# Altium schematic sheet MCU.SchDoc
size A; SheetNumber: 1; SheetTotal: 1
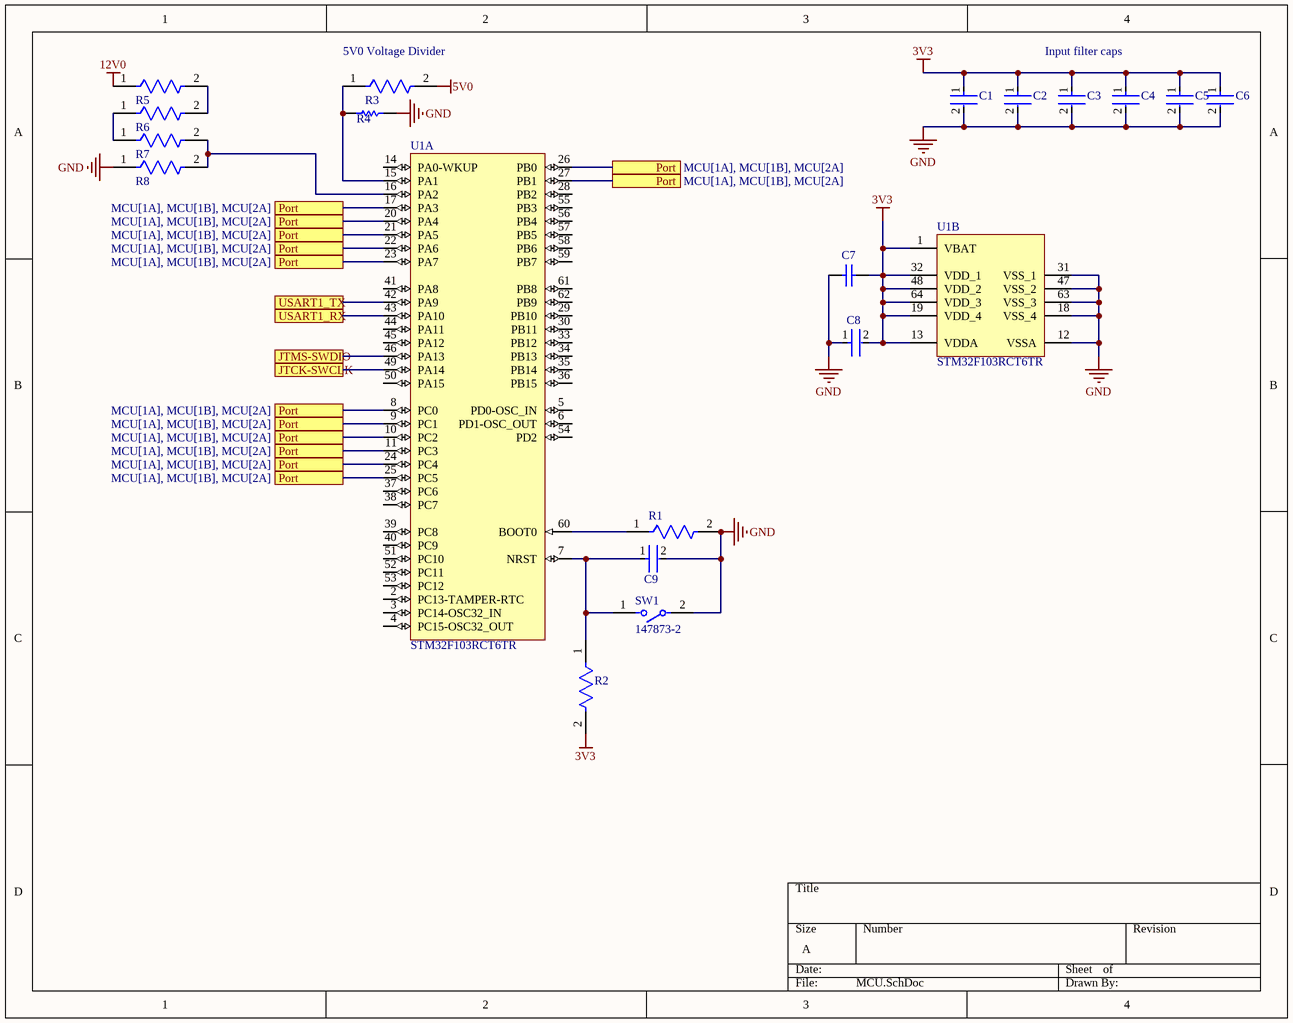
[diagram p0: MCU.SchDoc]

## Parts
C1  CL05A104KA5NNNC  [FP-CL278-IPC_C]  (value not drawn)
C2  CL05A104KA5NNNC  [FP-CL278-IPC_C]  (value not drawn)
C3  CL05A104KA5NNNC  [FP-CL278-IPC_C]  (value not drawn)
C4  CL05A104KA5NNNC  [FP-CL278-IPC_C]  (value not drawn)
C5  CL05A104KA5NNNC  [FP-CL278-IPC_C]  (value not drawn)
C6  CL05A104KA5NNNC  [FP-CL278-IPC_C]  (value not drawn)
C7  CL10A475KQ8NNNC  [CAPC1608X90X30LL10T20]  (value not drawn)
C8  CL10A105KA8NNNC  [FP-CL10-IPC_C]  (value not drawn)
C9  CL05A104KA5NNNC  [FP-CL278-IPC_C]  (value not drawn)
R1  RC0603FR-07100KL  [FP-RC0603-0_55-MFG]  (value not drawn)
R2  RC0603FR-07100KL  [FP-RC0603-0_55-MFG]  (value not drawn)
R3  RC0603FR-07100KL  [FP-RC0603-0_55-MFG]  (value not drawn)
R4  RN73H1ETTP1503B25  [RESC1005X40X25NL10T10]  (value not drawn)
R5  RC0603FR-07100KL  [FP-RC0603-0_55-MFG]  (value not drawn)
R6  RC0603FR-07100KL  [FP-RC0603-0_55-MFG]  (value not drawn)
R7  RC0603FR-07100KL  [FP-RC0603-0_55-MFG]  (value not drawn)
R8  RC0603FR-07100KL  [FP-RC0603-0_55-MFG]  (value not drawn)
SW1  147873-2  [FP-147873-2-MFG]
U1  STM32F103RCT6TR  [STM-LQFP64_N]  (parts A,B of 2)

## Ports
JTCK-SWCLK, JTMS-SWDIO, Port (see MCU[1A], MCU[1B], MCU[2A]), USART1_RX, USART1_TX

## Nets
3V3: C1.1 C2.1 C3.1 C4.1 C5.1 C6.1 C7.1 C8.2 R2.2 U1.1(VBAT) U1.13(VDDA) U1.19(VDD_4) U1.32(VDD_1) U1.48(VDD_2) U1.64(VDD_3)
5V0: R3.2
12V0: R5.1
GND: C1.2 C2.2 C3.2 C4.2 C5.2 C6.2 C7.2 C8.1 C9.2 R1.2 R4.2 R8.1 SW1.2 U1.12(VSSA) U1.18(VSS_4) U1.31(VSS_1) U1.47(VSS_2) U1.63(VSS_3)
JTCK-SWCLK: U1.49(PA14) ; port JTCK-SWCLK
JTMS-SWDIO: U1.46(PA13) ; port JTMS-SWDIO
Port: U1.8(PC0) U1.9(PC1) U1.10(PC2) U1.11(PC3) U1.17(PA3) U1.20(PA4) U1.21(PA5) U1.22(PA6) U1.23(PA7) U1.24(PC4) U1.25(PC5) U1.26(PB0) U1.27(PB1) ; port Port
USART1_RX: U1.43(PA10) ; port USART1_RX
USART1_TX: U1.42(PA9) ; port USART1_TX
NetC9_1: C9.1 R2.1 SW1.1 U1.7(NRST)
NetR1_1: R1.1 U1.60(BOOT0)
NetR3_1: R3.1 R4.1 U1.15(PA1)
NetR5_2: R5.2 R6.2
NetR6_1: R6.1 R7.1
NetR7_2: R7.2 R8.2 U1.16(PA2)

Not connected (* = marked no-connect by the designer): U1 2(PC13-TAMPER-RTC) 3(PC14-OSC32_IN) 4(PC15-OSC32_OUT) 5(PD0-OSC_IN) 6(PD1-OSC_OUT) 14(PA0-WKUP) 28(PB2) 29(PB10) 30(PB11) 33(PB12) 34(PB13) 35(PB14) 36(PB15) 37(PC6) 38(PC7) 39(PC8) 40(PC9) 41(PA8) 44(PA11) 45(PA12) 50(PA15) 51(PC10) 52(PC11) 53(PC12) 54(PD2) 55(PB3) 56(PB4) 57(PB5) 58(PB6) 59(PB7) 61(PB8) 62(PB9)

## Notes on the sheet
- (near R3) 5V0 Voltage Divider
- Input filter caps

## Library data of the parts
C1-C6 C9 = CMP-13271-000728-1: Cap Ceramic 100nF 25V X5R ±10% SMD 0402 +85°C Paper T/R; Package Quantity: 1; Height: 0.5mm; Case Code (Metric): 1005; Thickness: 0.022inch; Mount: Surface Mount; Lead Free: Lead Free; Case Code (Imperial): 0402; Packaging: Tape and Reel; Depth: 0.5mm; Voltage: 25V; Min Operating Temperature: -55°C; Voltage Rating: 25V; Dielectric: X5R; Case/Package: 0402; Tolerance: 10%; Width: 0.02inch; Max Operating Temperature: 85°C; Capacitance: 100nF; Length: 1mm; Radiation Hardening: No; Voltage Rating (DC): 25V
C7 = CMP-2000-06090-1: Chip Capacitor, 4.7 uF, +/- 10%, 6.3 V, -55 to 85 degC, 0603 (1608 Metric), RoHS, Tape and Reel; Manufacturer: Samsung Electro-Mechanics; Dielectric: X5R; Capacitance: 4700000pF; Rated Voltage: 6.3V; Manufacturer URL: http://www.samsungsem.com/global/index.jsp; Case Size/Dimension: 0603; Package Description: 2-Pin Surface Mount Device, Body 1.60 x 0.80 mm; Datasheet Version: 07/2016; Datasheet URL: http://www.samsungsem.com/kr/support/product-search/mlcc/__icsFiles/afieldfile/2016/08/18/S_CL10A475KQ8NNNC.pdf; Tolerance (%): ±10%; Mounting Technology: SurfaceMount; Package Reference: 0603
C8 = CMP-13271-004127-1: Cap Ceramic 1uF 25V X5R ±10% Pad SMD 0603 +85°C T/R; Height: 0.8mm; Capacitance: 1uF; Depth: 0.8mm; Package Quantity: 1; Mount: Surface Mount; Contact Plating: Tin; Voltage Rating: 25V; Dielectric: X5R; Packaging: Tape and Reel; Material: Ceramic; Case Code (Metric): 1608; Length: 1.6mm; Voltage: 25V; Min Operating Temperature: -55°C; Width: 0.031inch; Tolerance: 10%; Case/Package: 0603; Radiation Hardening: No; Case Code (Imperial): 0603; Thickness: 0.035inch; Lead Free: Lead Free; Max Operating Temperature: 85°C; Voltage Rating (DC): 25V
R1-R3 R5-R8 = CMP-2100-03662-2: RES SMD 100K OHM 1% 1/10W 0603; Voltage Rating (DC): 50V; Resistance: 100kR; Max Power Dissipation: 100mW; Temperature Coefficient: 100ppm/°C; Working Voltage: 75V; Length: 1.6mm; Lead Free: Lead Free; Number of Terminations: 2; Packaging: Tape and Reel; Voltage Rating: 50V; Termination: SMD/SMT; Width: 0.8mm; Resistor Type: Thick Film; Resistance Tolerance: 1%; Features: Moisture Resistant; Height: 0.45mm; Construction: Rectangular; Case/Package: 0603; Military Standard: Not; Case Code (Imperial): 0603; Series: RC; Technology: THICK FILM; Depth: 0.8mm; RoHS Compliant: Yes; REACH SVHC: No SVHC; Min Operating Temperature: -55°C; Case Code (Metric): 1608; Max Operating Temperature: 155°C; Power Rating: 100mW; Number of Pins: 2; Tolerance: 1%
R4 = CMP-2002-04586-1: Manufacturer: KOA Speer; Part Number: RN73H1ETTP1503B25
SW1 = CMP-03402-000024-1: SWITCH TACTILE SPST-NO 0.05A 24V; Contact Current Rating: 50mA; Mechanical Life: 40000Cycles; Actuator Length: 0.031inch; Operating Force: 1.77N; Contact Resistance: 100mR; Max Voltage Rating (DC): 12V; Illumination Type: Non-Illuminated; Switch Function: Off-Mom; Actuator Material: Polyphenylene; Throw Configuration: SPST; Switch Travel: 0.25mm; Housing Material: Thermoplastic; Package Quantity: 1; Contact Plating: Silver; Depth: 6.8mm; Electrical Life: 40000Cycles; Color: Black; Length: 3.5mm; Size: 6mm; Material: Polyamide; Height: 4.3mm; Current Rating: 50mA; Case/Package: SMD/SMT; Packaging: Tape and Reel; Mount: Surface Mount; RoHS Compliant: Yes; Voltage Rating (DC): 12V; Max Operating Temperature: 85°C; ELV: Compliant; Min Operating Temperature: -35°C; Lead Free: Lead Free; Termination: J-Bend; Orientation: Straight; Max Current Rating: 50mA; Radiation Hardening: No; Type: Switch; Contact Material: Copper Alloy; Series: FSMJM, Alcoswitch
U1 = CMP-0237-00202-3: ARM Cortex-M3 32-bit MCU, 256 KB Flash, 48 KB Internal RAM, 51 I/Os, 64-pin LQFP, -40 to 85 degC, Tape and Reel; FLASH Size (Prog) (kB): 256; D/A Converter: 2x12-bit (2 Channel); Operating Frequency(F) (Processor speed) (MHz): 72; Internal RAM Size (kB): 48; I/Os (High Current): 51; A/D Converter: 3x12-bit (16 Channel); Supply Voltage(Vcc) min (V): 2; ComponentLink1Description: Manufacturer URL; ComponentLink2Description: Datasheet; ComponentLink3URL: http://www.st.com/st-web-ui/static/active/en/resource/technical/document/datasheet/DM00037051.pdf; ComponentLink2URL: http://www.st.com/st-web-ui/static/active/en/resource/technical/document/datasheet/CD00191185.pdf; PackageDescription: 64-Pin Low Profile Quad Flat Package, 10 x 10 mm Body, 0.5 mm Pitch; ComponentLink3Description: Package Specification; PackageReference: LQFP64; Core: ARM Cortex-M3; PartNumber: STM32F103RCT6TR; Mounting Technology: Surface Mount; ComponentLink1URL: http://www.st.com/web/en/home.html; Packing: Tape and Reel; DatasheetVersion: Rev. 8; PackageVersion: Rev. 4, 06/2013